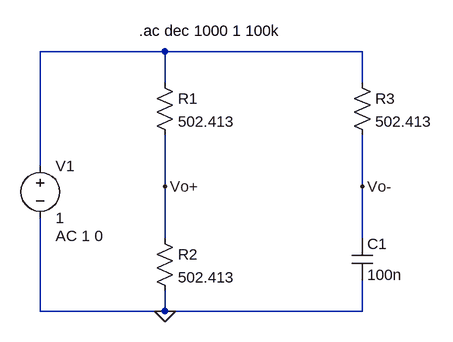
[diagram p0: schematic Ex6.asc]
Ex6.asc, the LTspice schematic file:
Version 4
SHEET 1 956 680
WIRE 208 -64 16 -64
WIRE 512 -64 208 -64
WIRE 208 -16 208 -64
WIRE 512 -16 512 -64
WIRE 16 112 16 -64
WIRE 208 144 208 64
WIRE 512 144 512 64
WIRE 208 224 208 144
WIRE 512 224 512 144
WIRE 16 336 16 192
WIRE 208 336 208 304
WIRE 208 336 16 336
WIRE 512 336 512 288
WIRE 512 336 208 336
FLAG 208 336 0
FLAG 208 144 Vo+
FLAG 512 144 Vo-
SYMBOL voltage 16 96 R0
WINDOW 123 24 124 Left 2
WINDOW 39 0 0 Left 0
SYMATTR InstName V1
SYMATTR Value 1
SYMATTR Value2 AC 1 0
SYMBOL res 192 208 R0
SYMATTR InstName R2
SYMATTR Value 502.413
SYMBOL cap 496 224 R0
SYMATTR InstName C1
SYMATTR Value 100n
SYMBOL res 192 -32 R0
SYMATTR InstName R1
SYMATTR Value 502.413
SYMBOL res 496 -32 R0
SYMATTR InstName R3
SYMATTR Value 502.413
TEXT 168 -96 Left 2 !.ac dec 1000 1 100k

The netlist it stands for:
* Ex6.asc
V1 N001 0 1 AC 1 0
R2 Vo+ 0 502.413
C1 Vo- 0 100n
R1 N001 Vo+ 502.413
R3 N001 Vo- 502.413
.ac dec 1000 1 100k
.backanno
.end